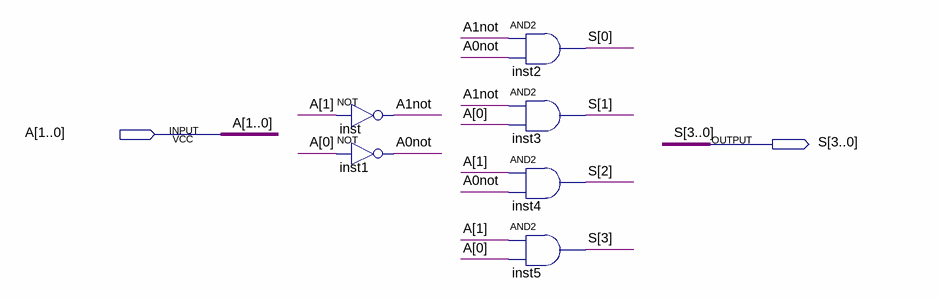
[diagram p0: schematic sheet]
// Quartus schematic 2_to_4_decoder.bdf as structural Verilog: 6 symbols, 2 pins
module \2_to_4_decoder  (
  input  [1:0] A,
  output [3:0] S
);

  wire A0not, A1not;

  not inst (A1not, A[1]);
  not inst1 (A0not, A[0]);
  and inst2 (S[0], A1not, A0not);
  and inst3 (S[1], A1not, A[0]);
  and inst4 (S[2], A[1], A0not);
  and inst5 (S[3], A[1], A[0]);
endmodule
